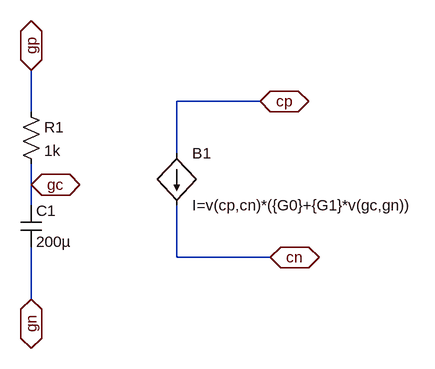
[diagram p0: schematic Capteur_graphite.asc]
Capteur_graphite.asc, the LTspice schematic file:
Version 4
SHEET 1 2808 19324
WIRE 496 80 368 80
WIRE 144 96 144 32
WIRE 368 160 368 80
WIRE 144 208 144 176
WIRE 144 240 144 208
WIRE 368 320 368 240
WIRE 512 320 368 320
WIRE 144 384 144 304
FLAG 144 32 gp
IOPIN 144 32 BiDir
FLAG 144 384 gn
IOPIN 144 384 BiDir
FLAG 144 208 gc
IOPIN 144 208 BiDir
FLAG 496 80 cp
IOPIN 496 80 BiDir
FLAG 512 320 cn
IOPIN 512 320 BiDir
SYMBOL res 128 80 R0
SYMATTR InstName R1
SYMATTR Value 1k
SYMBOL cap 128 240 R0
SYMATTR InstName C1
SYMATTR Value 200µ
SYMBOL bi 368 160 R0
SYMATTR InstName B1
SYMATTR Value I=v(cp,cn)*({G0}+{G1}*v(gc,gn))

The netlist it stands for:
* Capteur_graphite.asc
R1 gp gc 1k
C1 gc gn 200µ
B1 cp cn I=v(cp,cn)*({G0}+{G1}*v(gc,gn))
.backanno
.end